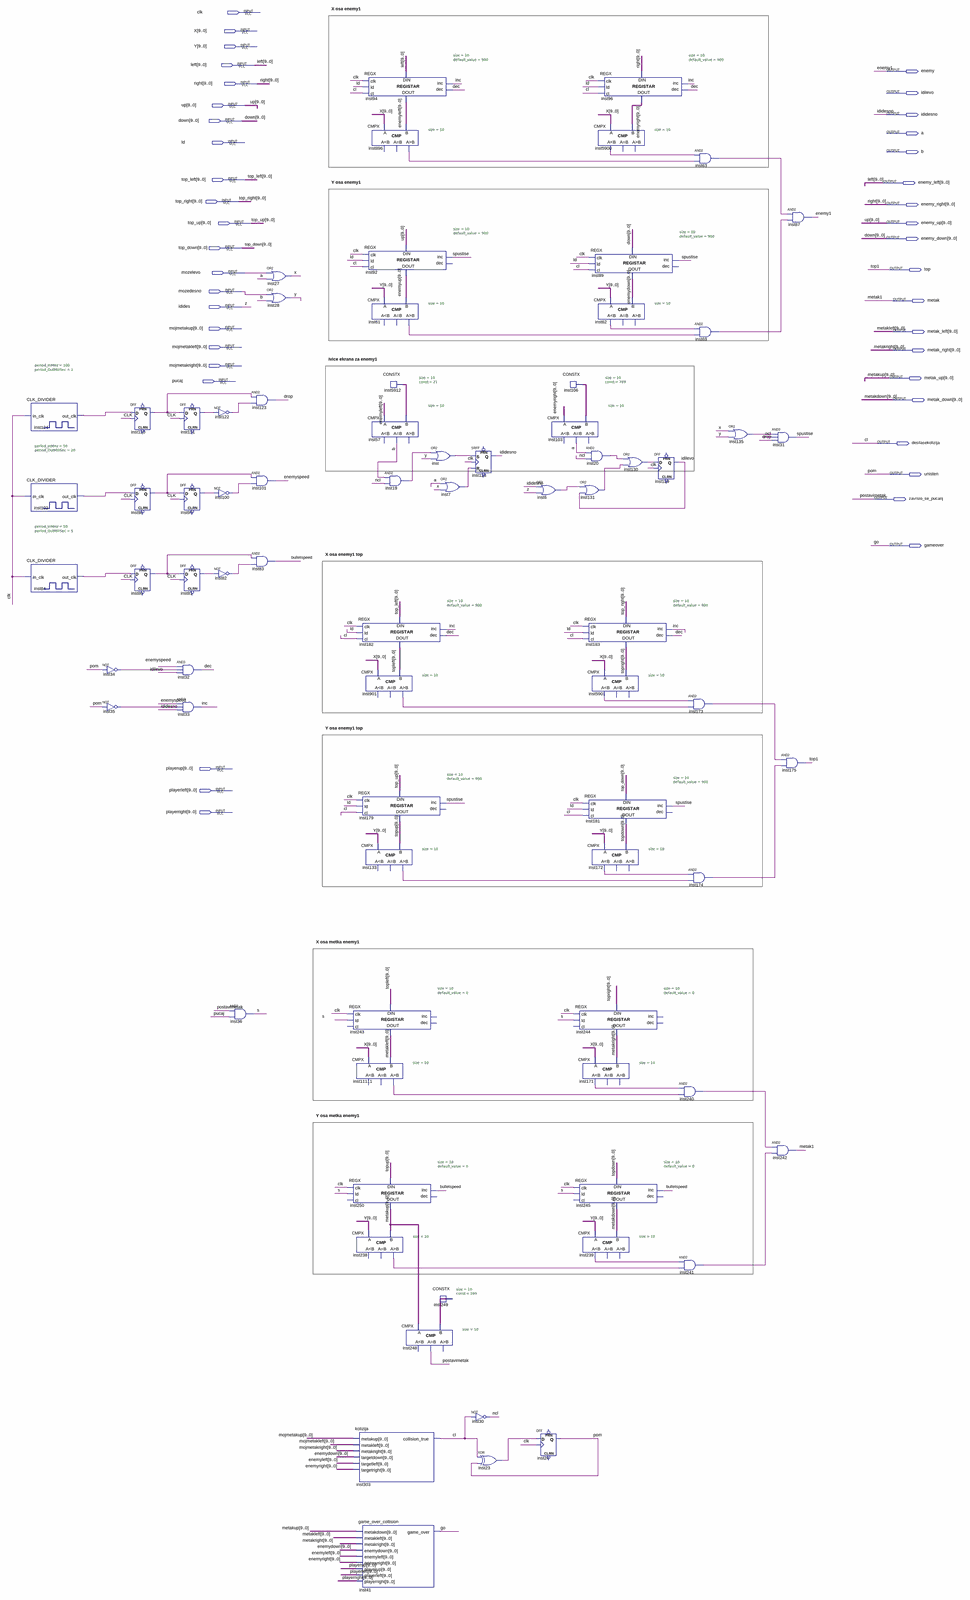
[diagram p0: schematic sheet, whole]
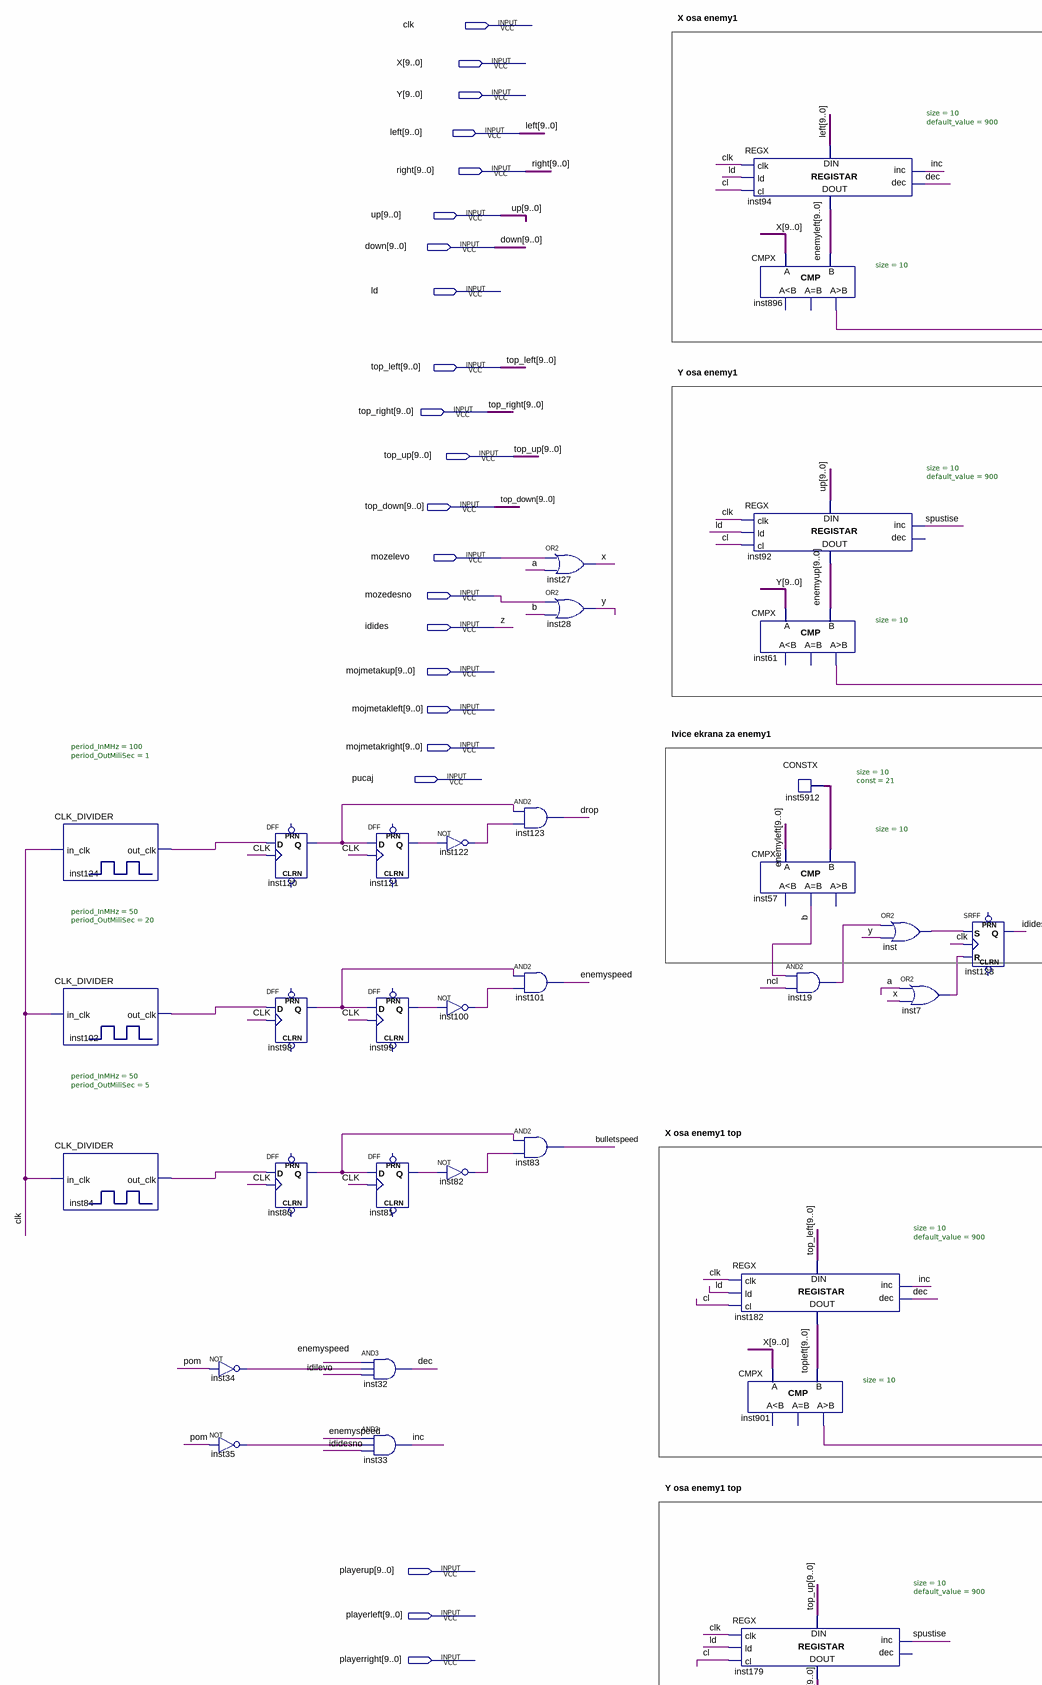
[diagram p1: schematic sheet, upper left part]
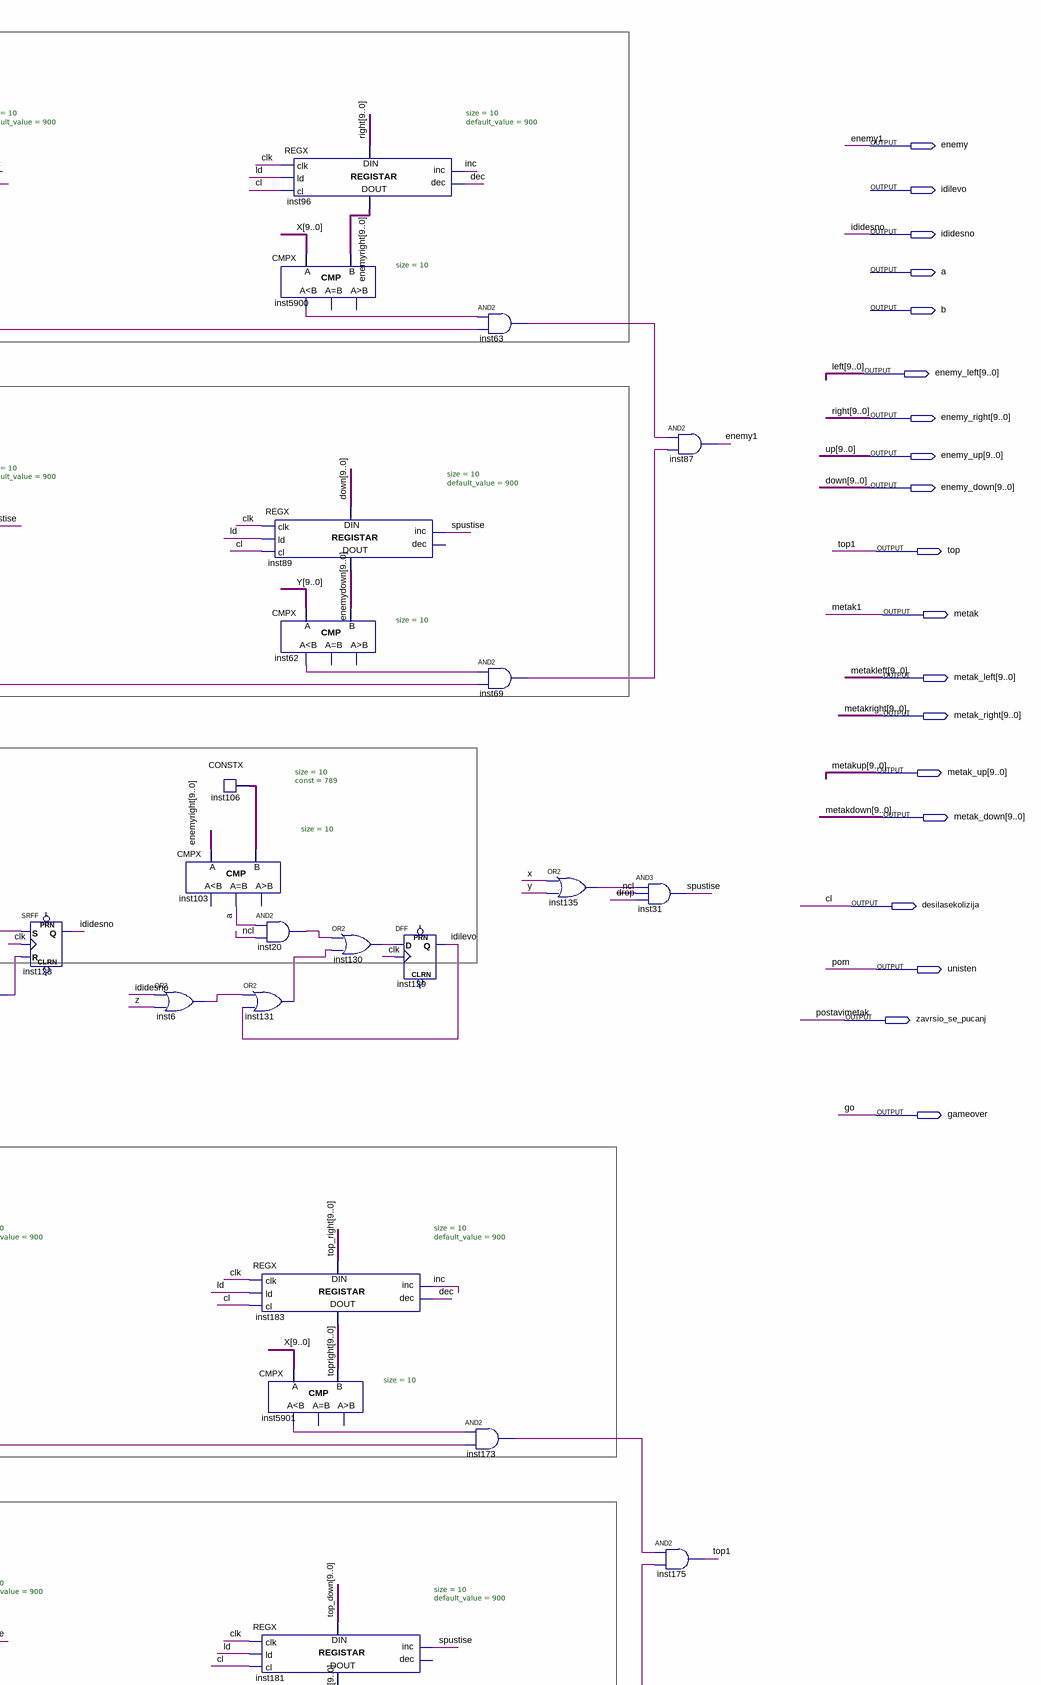
[diagram p2: schematic sheet, upper right part]
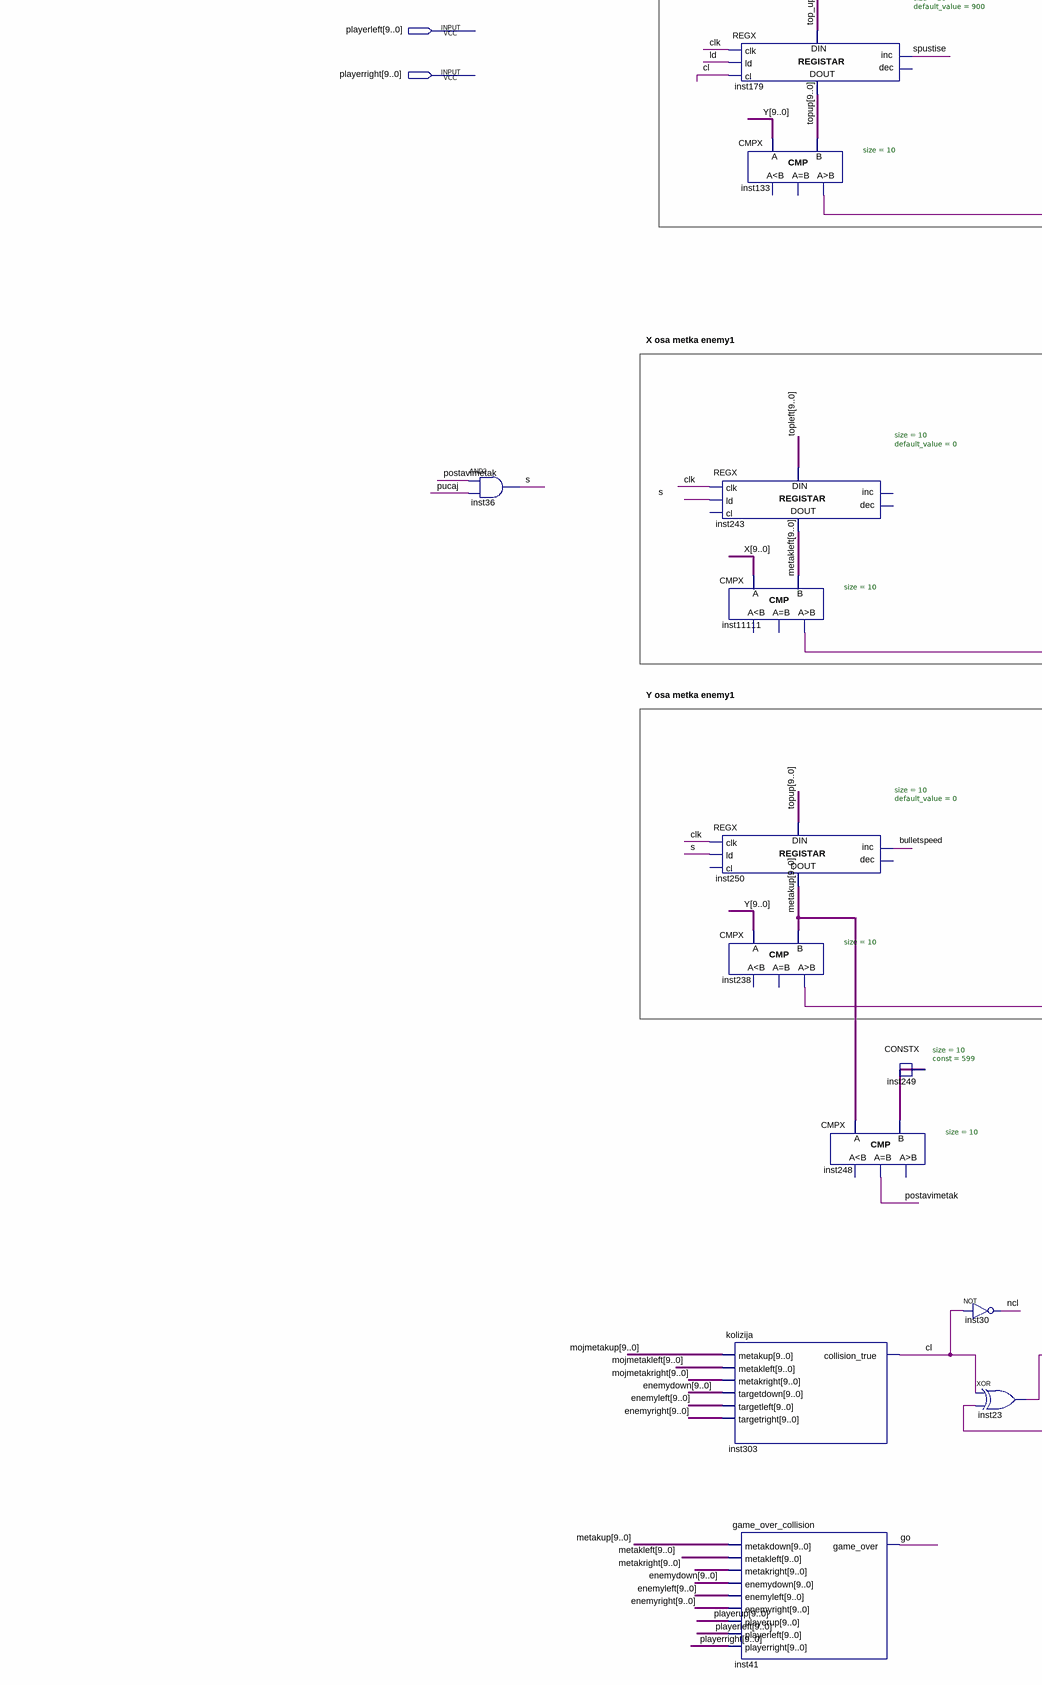
[diagram p3: schematic sheet, lower left part]
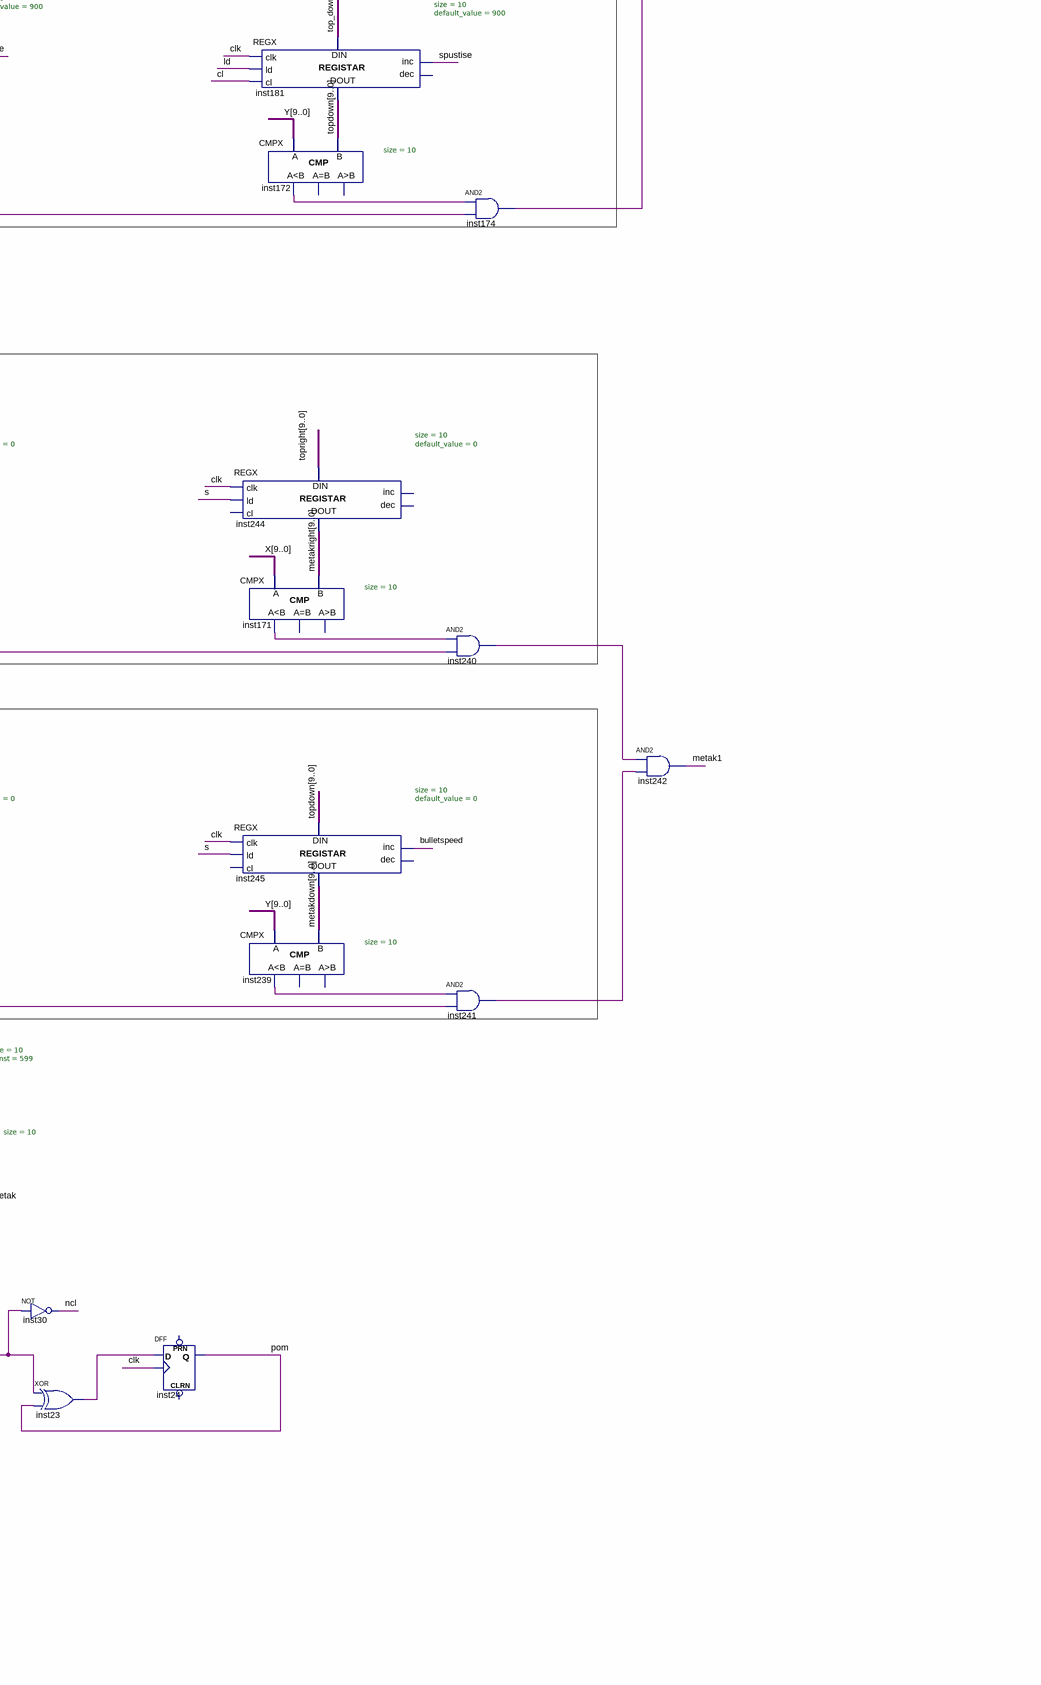
[diagram p4: schematic sheet, lower right part]
// Quartus schematic enemy.bdf as structural Verilog: 77 symbols, 41 pins
module enemy (
  input  clk,
  input  [9:0] X,
  input  [9:0] Y,
  input  [9:0] left,
  input  [9:0] right,
  input  [9:0] up,
  input  [9:0] down,
  input  ld,
  input  [9:0] top_left,
  input  [9:0] top_right,
  input  [9:0] top_up,
  input  [9:0] top_down,
  input  mozelevo,
  input  mozedesno,
  input  idides,
  input  [9:0] mojmetakup,
  input  [9:0] mojmetakleft,
  input  [9:0] mojmetakright,
  input  pucaj,
  input  [9:0] playerup,
  input  [9:0] playerleft,
  input  [9:0] playerright,
  output enemy,
  output idilevo,
  output ididesno,
  output a,
  output b,
  output [9:0] enemy_left,
  output [9:0] enemy_right,
  output [9:0] enemy_up,
  output [9:0] enemy_down,
  output top,
  output metak,
  output [9:0] metak_left,
  output [9:0] metak_right,
  output [9:0] metak_up,
  output [9:0] metak_down,
  output desilasekolizija,
  output unisten,
  output zavrsio_se_pucanj,
  output gameover
);

  wire bulletspeed, dec, drop, enemyspeed, inc, inst6_out, inst7_out, inst19_out, inst20_out, inst23_out,
       inst34_out, inst35_out, inst61_gr, inst62_ls, inst63_out, inst69_out, inst80_q, inst81_q, inst82_out,
       inst84_out_clk, inst98_q, inst99_q, inst100_out, inst102_out_clk, inst120_q, inst121_q, inst122_out,
       inst124_out_clk, inst130_out, inst131_out, inst133_gr, inst135_out, inst171_ls, inst172_ls,
       inst173_out, inst174_out, inst238_gr, inst239_ls, inst240_out, inst241_out, inst896_gr, inst901_gr,
       inst5900_ls, inst5901_ls, inst11111_gr, inst_out, ncl, s, spustise, X_1bit, Y_1bit;
  wire [9:0] enemydown, enemyleft, enemyright, enemyup, inst106_data, inst249_data, inst5912_data, topdown,
       topleft, topright, topup;

  CLK_DIVIDER #(.period_InMHz(100), .period_OutMiliSec(1)) inst124 (.in_clk(clk), .out_clk(inst124_out_clk));
  CLK_DIVIDER #(.period_InMHz(50), .period_OutMiliSec(20)) inst102 (.in_clk(clk), .out_clk(inst102_out_clk));
  CLK_DIVIDER #(.period_InMHz(50), .period_OutMiliSec(5)) inst84 (.in_clk(clk), .out_clk(inst84_out_clk));
  not inst34 (inst34_out, unisten);
  not inst35 (inst35_out, unisten);
  DFF inst120 (.CLK(clk), .D(inst124_out_clk), .Q(inst120_q));  // open: CLRN, PRN
  DFF inst98 (.CLK(clk), .D(inst102_out_clk), .Q(inst98_q));  // open: CLRN, PRN
  DFF inst80 (.CLK(clk), .D(inst84_out_clk), .Q(inst80_q));  // open: CLRN, PRN
  DFF inst121 (.CLK(clk), .D(inst120_q), .Q(inst121_q));  // open: CLRN, PRN
  DFF inst99 (.CLK(clk), .D(inst98_q), .Q(inst99_q));  // open: CLRN, PRN
  DFF inst81 (.CLK(clk), .D(inst80_q), .Q(inst81_q));  // open: CLRN, PRN
  and inst32 (dec, enemyspeed, inst34_out, idilevo);
  and inst33 (inc, enemyspeed, inst35_out, ididesno);
  not inst122 (inst122_out, inst121_q);
  not inst100 (inst100_out, inst99_q);
  not inst82 (inst82_out, inst81_q);
  and inst36 (s, zavrsio_se_pucanj, pucaj);
  or inst27 (X_1bit, mozelevo, a);
  or inst28 (Y_1bit, mozedesno, b);
  and inst123 (drop, inst120_q, inst122_out);
  and inst101 (enemyspeed, inst98_q, inst100_out);
  and inst83 (bulletspeed, inst80_q, inst82_out);
  REGX #(.size(10), .default_value(900)) inst94 (
    .clk(clk), .ld(ld), .cl(desilasekolizija), .inc(inc), .dec(dec), .data_in(left), .data_out(enemyleft));
  CMPX #(.size(10)) inst896 (.A(X), .B(enemyleft), .gr(inst896_gr));  // open: ls, eq
  REGX #(.size(10), .default_value(900)) inst92 (
    .clk(clk), .ld(ld), .cl(desilasekolizija), .inc(spustise), .data_in(up), .data_out(enemyup));  // open: dec
  CMPX #(.size(10)) inst61 (.A(Y), .B(enemyup), .gr(inst61_gr));  // open: ls, eq
  CMPX #(.size(10)) inst57 (.A(enemyleft), .B(inst5912_data), .eq(b));  // open: ls, gr
  REGX #(.size(10), .default_value(900)) inst182 (
    .clk(clk), .ld(ld), .cl(desilasekolizija), .inc(inc), .dec(dec), .data_in(top_left), .data_out(topleft));
  CMPX #(.size(10)) inst901 (.A(X), .B(topleft), .gr(inst901_gr));  // open: ls, eq
  REGX #(.size(10), .default_value(900)) inst179 (
    .clk(clk), .ld(ld), .cl(desilasekolizija), .inc(spustise), .data_in(top_up), .data_out(topup));  // open: dec
  CMPX #(.size(10)) inst133 (.A(Y), .B(topup), .gr(inst133_gr));  // open: ls, eq
  REGX #(.size(10), .default_value(0)) inst243 (
    .clk(clk), .ld(s), .data_in(topleft), .data_out(metak_left));  // open: cl, inc, dec
  CMPX #(.size(10)) inst11111 (.A(X), .B(metak_left), .gr(inst11111_gr));  // open: ls, eq
  REGX #(.size(10), .default_value(0)) inst250 (
    .clk(clk), .ld(s), .inc(bulletspeed), .data_in(topup), .data_out(metak_up));  // open: cl, dec
  CMPX #(.size(10)) inst238 (.A(Y), .B(metak_up), .gr(inst238_gr));  // open: ls, eq
  kolizija inst303 (
    .metakup(mojmetakup), .metakleft(mojmetakleft), .metakright(mojmetakright), .targetdown(enemydown),
    .targetleft(enemyleft), .targetright(enemyright), .collision_true(desilasekolizija));
  game_over_collision inst41 (
    .metakdown(metak_up), .metakleft(metak_left), .metakright(metak_right), .enemydown(enemydown),
    .enemyleft(enemyleft), .enemyright(enemyright), .playerup(playerup), .playerleft(playerleft),
    .playerright(playerright), .game_over(gameover));
  CONSTX #(.size(10), .\const (21)) inst5912 (.data(inst5912_data));
  and inst19 (inst19_out, b, ncl);
  CMPX #(.size(10)) inst248 (.A(metak_up), .B(inst249_data), .eq(zavrsio_se_pucanj));  // open: ls, gr
  or inst (inst_out, inst19_out, Y_1bit);
  or inst7 (inst7_out, a, X_1bit);
  CONSTX #(.size(10), .\const (599)) inst249 (.data(inst249_data));
  SRFF inst128 (.S(inst_out), .R(inst7_out), .CLK(clk), .Q(ididesno));  // open: PRN, CLRN
  not inst30 (ncl, desilasekolizija);
  xor inst23 (inst23_out, desilasekolizija, unisten);
  or inst6 (inst6_out, ididesno, idides);
  DFF inst24 (.CLK(clk), .D(inst23_out), .Q(unisten));  // open: CLRN, PRN
  CONSTX #(.size(10), .\const (789)) inst106 (.data(inst106_data));
  CMPX #(.size(10)) inst103 (.A(enemyright), .B(inst106_data), .eq(a));  // open: ls, gr
  REGX #(.size(10), .default_value(900)) inst89 (
    .clk(clk), .ld(ld), .cl(desilasekolizija), .inc(spustise), .data_in(down), .data_out(enemydown));  // open: dec
  and inst20 (inst20_out, a, ncl);
  or inst131 (inst131_out, inst6_out, idilevo);
  REGX #(.size(10), .default_value(900)) inst183 (
    .clk(clk), .ld(ld), .cl(desilasekolizija), .inc(inc), .dec(dec), .data_in(top_right), .data_out(topright));
  CMPX #(.size(10)) inst5901 (.A(X), .B(topright), .ls(inst5901_ls));  // open: eq, gr
  REGX #(.size(10), .default_value(900)) inst181 (
    .clk(clk), .ld(ld), .cl(desilasekolizija), .inc(spustise), .data_in(top_down), .data_out(topdown));  // open: dec
  CMPX #(.size(10)) inst172 (.A(Y), .B(topdown), .ls(inst172_ls));  // open: eq, gr
  REGX #(.size(10), .default_value(0)) inst244 (
    .clk(clk), .ld(s), .data_in(topright), .data_out(metak_right));  // open: cl, inc, dec
  CMPX #(.size(10)) inst171 (.A(X), .B(metak_right), .ls(inst171_ls));  // open: eq, gr
  REGX #(.size(10), .default_value(0)) inst245 (
    .clk(clk), .ld(s), .inc(bulletspeed), .data_in(topdown), .data_out(metak_down));  // open: cl, dec
  CMPX #(.size(10)) inst239 (.A(Y), .B(metak_down), .ls(inst239_ls));  // open: eq, gr
  REGX #(.size(10), .default_value(900)) inst96 (
    .clk(clk), .ld(ld), .cl(desilasekolizija), .inc(inc), .dec(dec), .data_in(right), .data_out(enemyright));
  CMPX #(.size(10)) inst5900 (.A(X), .B(enemyright), .ls(inst5900_ls));  // open: eq, gr
  CMPX #(.size(10)) inst62 (.A(Y), .B(enemydown), .ls(inst62_ls));  // open: eq, gr
  or inst130 (inst130_out, inst20_out, inst131_out);
  DFF inst129 (.CLK(clk), .D(inst130_out), .Q(idilevo));  // open: CLRN, PRN
  and inst173 (inst173_out, inst5901_ls, inst901_gr);
  and inst174 (inst174_out, inst172_ls, inst133_gr);
  and inst240 (inst240_out, inst171_ls, inst11111_gr);
  and inst241 (inst241_out, inst239_ls, inst238_gr);
  and inst63 (inst63_out, inst5900_ls, inst896_gr);
  and inst69 (inst69_out, inst62_ls, inst61_gr);
  or inst135 (inst135_out, X_1bit, Y_1bit);
  and inst87 (enemy, inst63_out, inst69_out);
  and inst31 (spustise, inst135_out, ncl, drop);
  and inst175 (top, inst173_out, inst174_out);
  and inst242 (metak, inst240_out, inst241_out);

  assign enemy_down = down;
  assign enemy_left = left;
  assign enemy_right = right;
  assign enemy_up = up;

  // Other names for the same wires on the sheet: cl = desilasekolizija; enemy1 = enemy; go = gameover; metak1 = metak;
  //   metakdown[9:0] = metak_down; metakleft[9:0] = metak_left; metakright[9:0] = metak_right;
  //   metakup[9:0] = metak_up; pom = unisten; postavimetak = zavrsio_se_pucanj; top1 = top; z = idides

  // Notes on the sheet:
  //   X osa enemy1
  //   Y osa enemy1
  //   Ivice ekrana za enemy1
  //   X osa enemy1 top
  //   Y osa enemy1 top
  //   X osa metka enemy1
  //   Y osa metka enemy1
endmodule
